# Altium schematic sheet RCD300_AMPLIFIER_P1.SchDoc
size A4
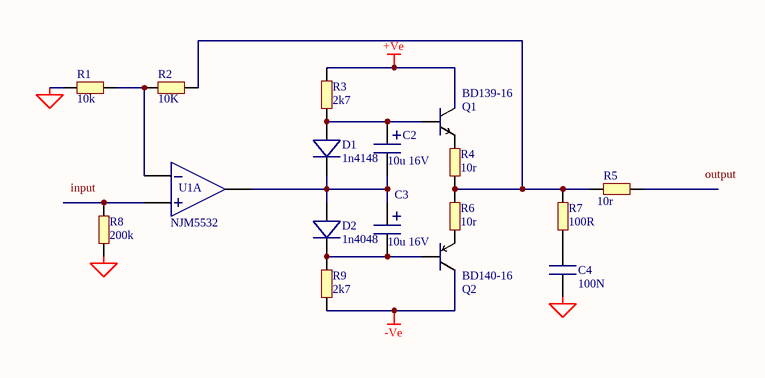
[diagram p0: RCD300_AMPLIFIER_P1.SchDoc]

## Parts
C2  10u 16V  [CAP CASE B]
C3  10u 16V  [CAP CASE B]
C4  100N  [CAP 0805]
D1  1n4148  [SOT-23]
D2  1n4048  [SOT-23]
Q1  BD139-16  [TO-126-V]
Q2  BD140-16  [TO-126-V]
R1  10k  [RES 0805]
R2  10K  [RES 0805]
R3  2k7  [RES 0805]
R4  10r  [RES 1206]
R5  10r  [RES 1206]
R6  10r  [RES 1206]
R7  100R  [RES 0805]
R8  200k  [RES 0805]
R9  2k7  [RES 0805]
U1  NJM5532  [DIP-8 SOCKETED]  (part A of 3)

## Nets
+Ve: Q1.2(C) R3.2
-Ve: Q2.2(C) R9.1
SGND: C4.1 R1.1 R8.1
NetC2_1: C2.1 D1.1(A) Q1.3(B) R3.1
NetC2_2: C2.2 C3.1 D1.3(C) D2.1(A) U1.1(OUTPUT)
NetC3_2: C3.2 D2.3(C) Q2.3(B) R9.2
NetC4_2: C4.2 R7.1
NetQ1_1: Q1.1(E) R4.1
NetQ2_1: Q2.1(E) R6.2
NetR1_2: R1.2 R2.1 U1.2(INV)
NetR2_2: R2.2 R4.2 R5.1 R6.1 R7.2
NetR8_2: R8.2 U1.3(NONINV)

Not connected (* = marked no-connect by the designer): R5 2

## Notes on the sheet
- Labels drawn without touching a wire or pin: input, output

## Library data of the parts
C2 C3 = 10u 16V: Standard Case B Electrolytic Capacitor; Type: Al; Voltage: 16; UA P/N: 16-0026; Value: 10u 16V
C4 = 100N: Standard 0805 Capacitor; Type: X7R; Voltage: 50V; UA P/N: 16-0001; Value: 100N; Footprint: 0805
D1 D2 = BAS21: SOT23 Diode; Value: BAS21; Type: SIG DIODE; UA P/N: 15-0007
Q1 = BD139-16: NPN TO126 Transistor; Type: BD139; Value: BD139-16; Farnell PN: 108-4508
Q2 = BD140-16: PNP TO126 Transistor; Type: BD140; Value: BD140-16; Farnell PN: 108-4566
R1 = 3k9: Standard 0805 Resistor; Value: 3K9; UA P/N: 13-0053; Footprint: 0805; Type: THICK FILM
R2 = 10K: Standard 0805 Resistor; UA P/N: 13-0007; Value: 10K; Footprint: 0805; Type: THICK FILM
R3 R9 = 4K7: Standard 0805 Resistor; Value: 4K7; UA P/N: 13-0060; Footprint: 0805; Type: THICK FILM
R4-R6 = 1206 4R7: Standard 1206 Resistor; UA P/N: 13-0083; Value: 1206 4R7; Footprint: 1206; Type: Thick Film
R7 = 100R: Standard 0805 Resistor; UA P/N: 13-0004; Value: 100R; Footprint: 0805; Type: THICK FILM
R8 = 100K: Standard 0805 Resistor; Value: 100K; UA P/N: 13-0002; Footprint: 0805; Type: THICK FILM
U1 = NJM5532: Dual OPAMP DIP8 socketed; UA P/N: 15-1046; Value: NJM5532; Type: BIPOLAR OP-AMP DUAL